# EAGLE schematic backplane (EAGLE 9.6.2)

## Sheet 1 of 5
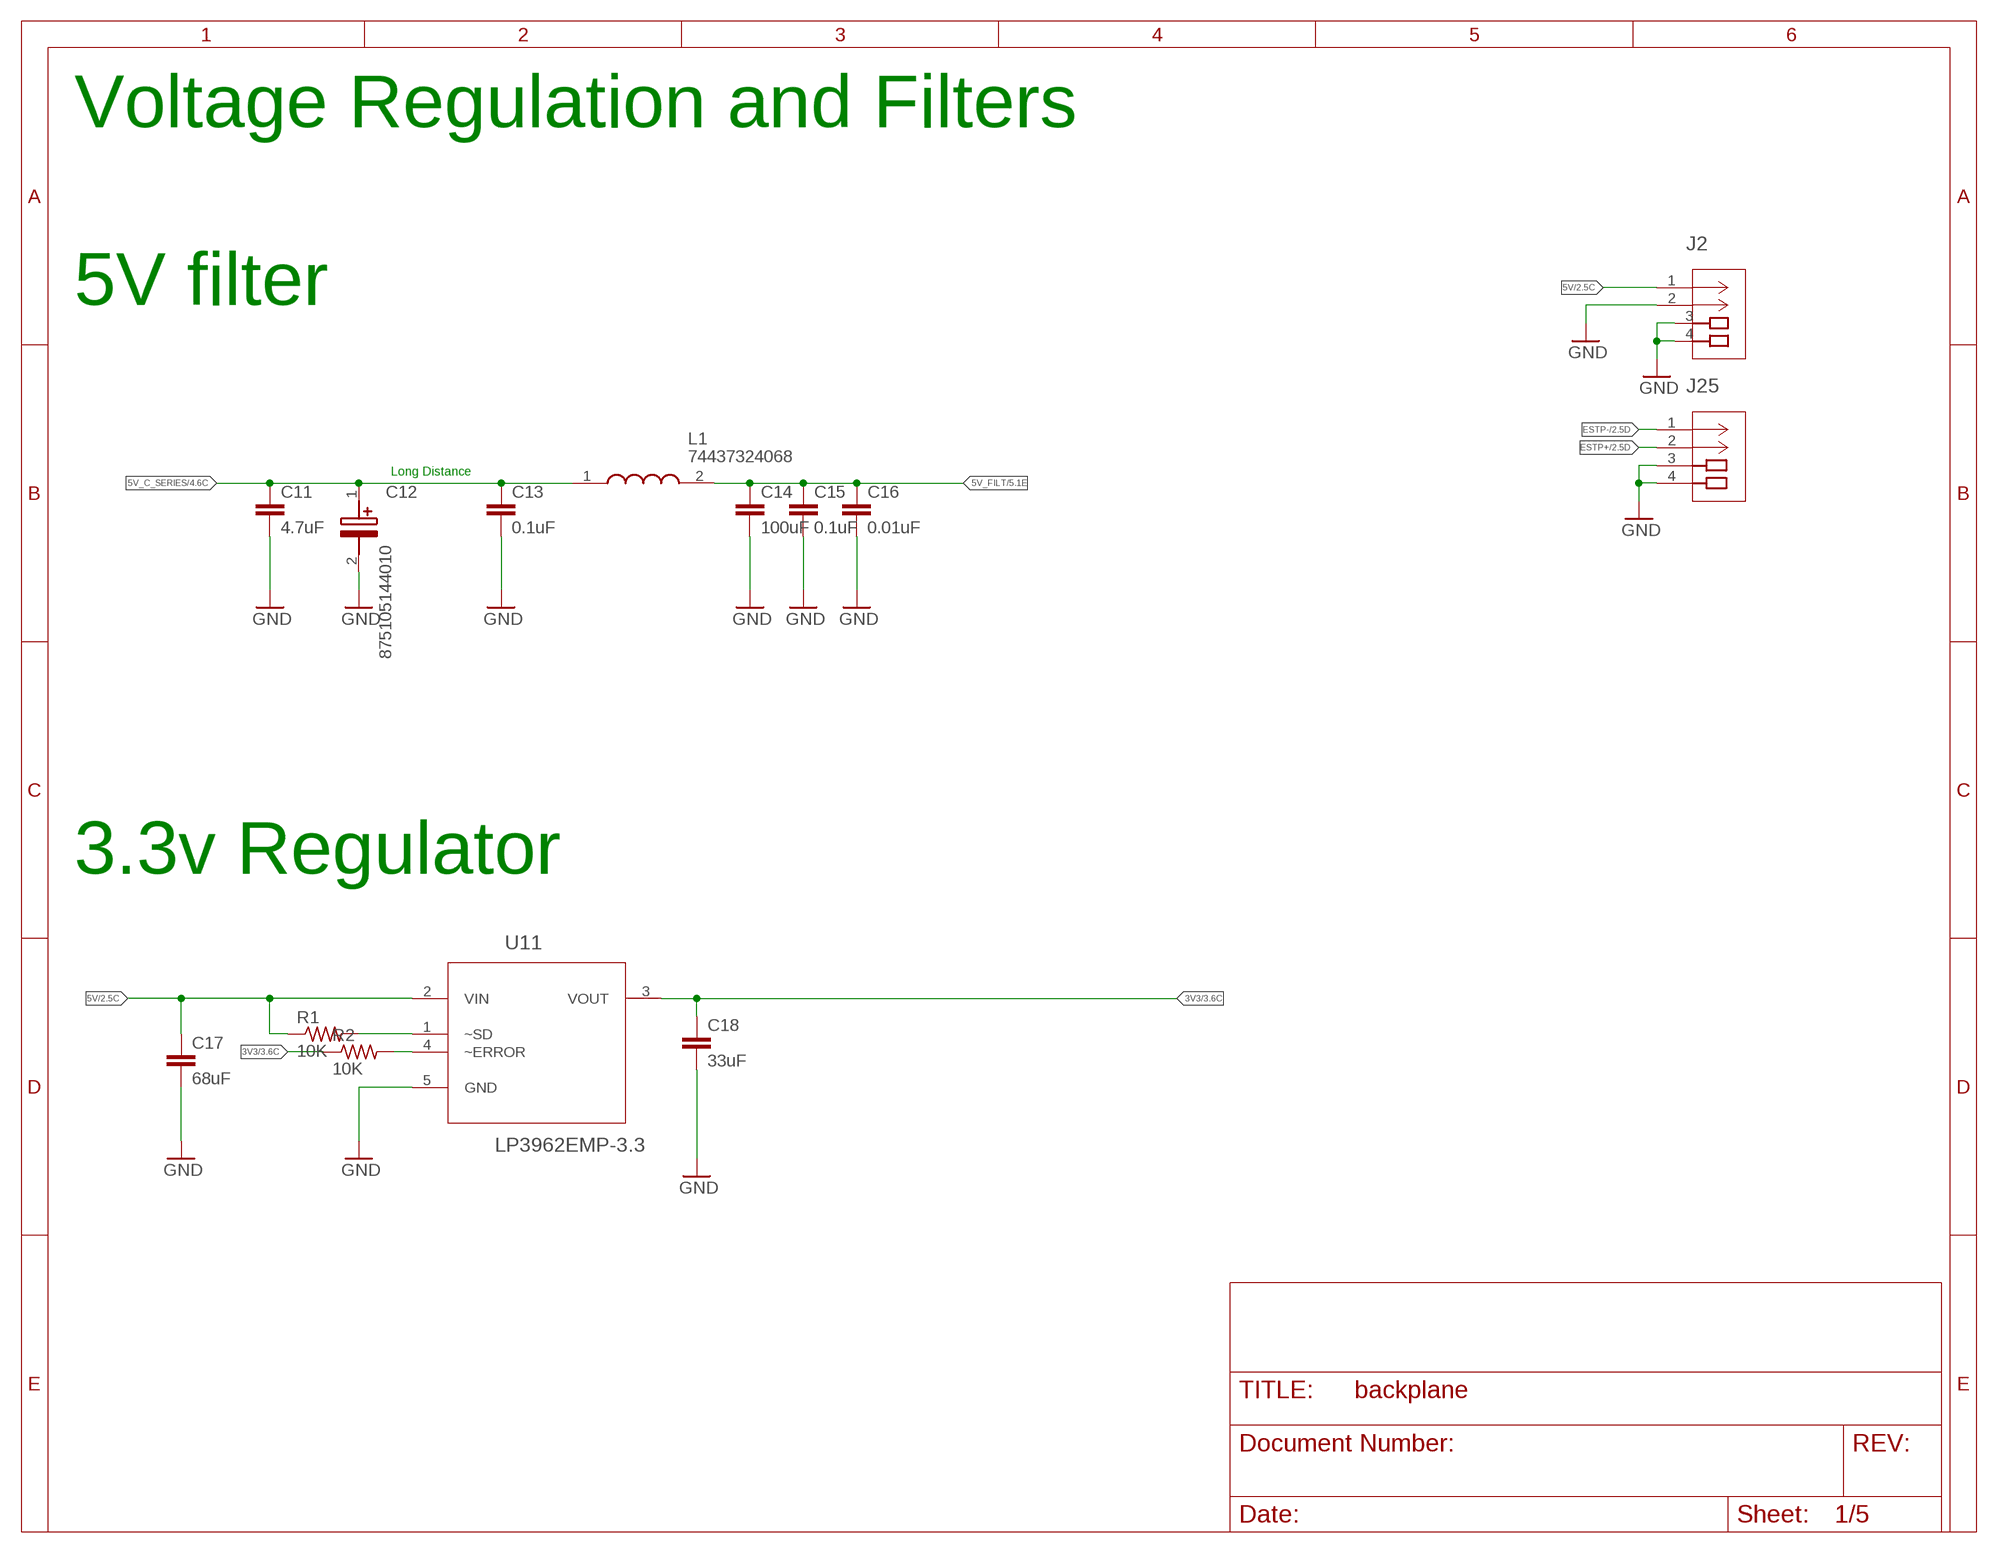
[diagram p0: schematic, sheet 1]

### Parts
C11  4.7uF  C-EUC0603  [C0603]
C12  875105144010  [CAPAE660X580N]
C13  0.1uF  C-EUC0603  [C0603]
C14  100uF  C-EUC1206  [C1206]
C15  0.1uF  C-EUC0603  [C0603]
C16  0.01uF  C-EUC0603  [C0603]
C17  68uF  C-EUC1206  [C1206]
C18  33uF  C-EUC1206  [C1206]
J2  1054301102  [CON_1054301102_MOL]
J25  5055670271  [CON_5055670271]
L1  74437324068  [WE-LHMI_402048]
R1  10K  R-US_R0603  [R0603]
R2  10K  R-US_R0603  [R0603]
U11  LP3962EMP-3.3  [SOT150P696X180-5N]

### Nets
3V3: C18.1 R2.1 U11.3(VOUT) ; also sheet 3
5V: C17.1 J2.1 R1.1 U11.2(VIN) ; also sheet 2
5V_C_SERIES: C11.1 C12.1(+) C13.1 L1.1 ; also sheet 4,5
5V_FILT: C14.1 C15.1 C16.1 L1.2 ; also sheet 5
ESTP+: J25.2 ; also sheet 2
ESTP-: J25.1 ; also sheet 2
GND: C11.2 C12.2(-) C13.2 C14.2 C15.2 C16.2 C17.2 C18.2 J2.2 J2.3 J2.4 J25.3 J25.4 U11.5(GND) ; also sheet 2,3,4,5
N$1: R1.2 U11.1(~SD)
N$2: R2.2 U11.4(~ERROR)

### Notes on the sheet
- Voltage Regulation and Filters
- 5V filter
- Long Distance
- 3.3v Regulator

## Sheet 2 of 5
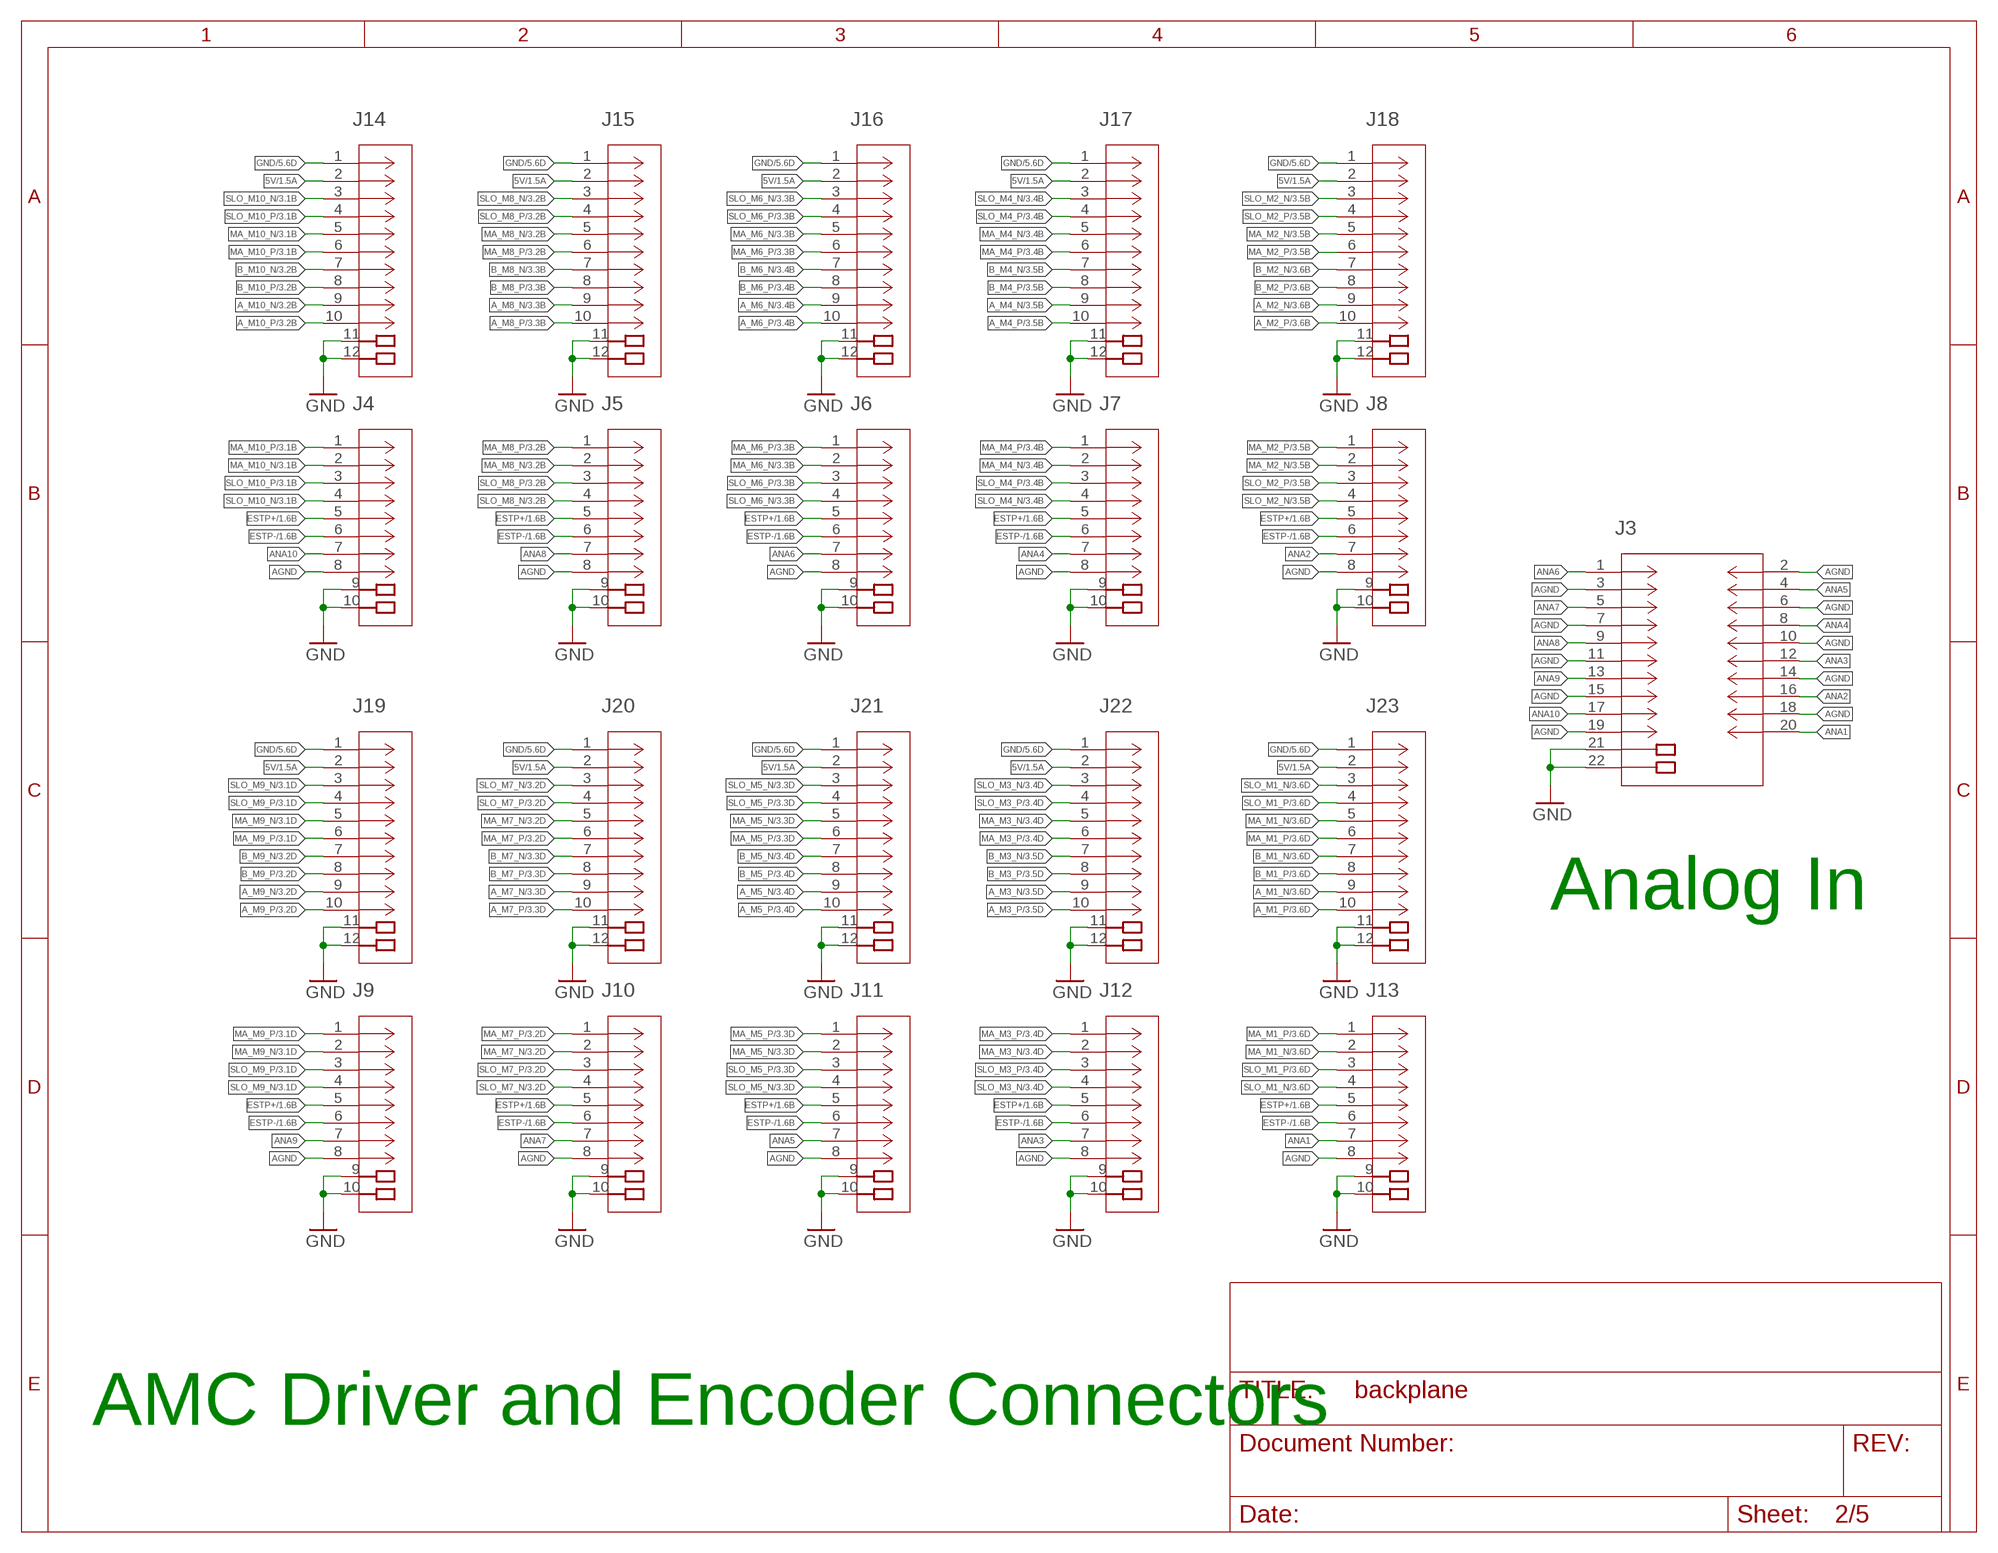
[diagram p1: schematic, sheet 2]

### Parts
J3  5011902017  [CON_5011902017]
J4  5013310807  [CON_5013310807]
J5  5013310807  [CON_5013310807]
J6  5013310807  [CON_5013310807]
J7  5013310807  [CON_5013310807]
J8  5013310807  [CON_5013310807]
J9  5013310807  [CON_5013310807]
J10  5013310807  [CON_5013310807]
J11  5013310807  [CON_5013310807]
J12  5013310807  [CON_5013310807]
J13  5013310807  [CON_5013310807]
J14  5013311007  [CON_5013311007]
J15  5013311007  [CON_5013311007]
J16  5013311007  [CON_5013311007]
J17  5013311007  [CON_5013311007]
J18  5013311007  [CON_5013311007]
J19  5013311007  [CON_5013311007]
J20  5013311007  [CON_5013311007]
J21  5013311007  [CON_5013311007]
J22  5013311007  [CON_5013311007]
J23  5013311007  [CON_5013311007]

### Nets
5V: J14.2 J15.2 J16.2 J17.2 J18.2 J19.2 J20.2 J21.2 J22.2 J23.2 ; also sheet 1
A_M1_N [RS422]: J23.9 ; also sheet 3
A_M1_P [RS422]: J23.10 ; also sheet 3
A_M2_N [RS422]: J18.9 ; also sheet 3
A_M2_P [RS422]: J18.10 ; also sheet 3
A_M3_N [RS422]: J22.9 ; also sheet 3
A_M3_P [RS422]: J22.10 ; also sheet 3
A_M4_N [RS422]: J17.9 ; also sheet 3
A_M4_P [RS422]: J17.10 ; also sheet 3
A_M5_N [RS422]: J21.9 ; also sheet 3
A_M5_P [RS422]: J21.10 ; also sheet 3
A_M6_N [RS422]: J16.9 ; also sheet 3
A_M6_P [RS422]: J16.10 ; also sheet 3
A_M7_N [RS422]: J20.9 ; also sheet 3
A_M7_P [RS422]: J20.10 ; also sheet 3
A_M8_N [RS422]: J15.9 ; also sheet 3
A_M8_P [RS422]: J15.10 ; also sheet 3
A_M9_N [RS422]: J19.9 ; also sheet 3
A_M9_P [RS422]: J19.10 ; also sheet 3
A_M10_N [RS422]: J14.9 ; also sheet 3
A_M10_P [RS422]: J14.10 ; also sheet 3
AGND [Analog]: J3.2 J3.3 J3.6 J3.7 J3.10 J3.11 J3.14 J3.15 J3.18 J3.19 J4.8 J5.8 J6.8 J7.8 J8.8 J9.8 J10.8 J11.8 J12.8 J13.8
ANA1 [Analog]: J3.20 J13.7
ANA2 [Analog]: J3.16 J8.7
ANA3 [Analog]: J3.12 J12.7
ANA4 [Analog]: J3.8 J7.7
ANA5 [Analog]: J3.4 J11.7
ANA6 [Analog]: J3.1 J6.7
ANA7 [Analog]: J3.5 J10.7
ANA8 [Analog]: J3.9 J5.7
ANA9 [Analog]: J3.13 J9.7
ANA10 [Analog]: J3.17 J4.7
B_M1_N [RS422]: J23.7 ; also sheet 3
B_M1_P [RS422]: J23.8 ; also sheet 3
B_M2_N [RS422]: J18.7 ; also sheet 3
B_M2_P [RS422]: J18.8 ; also sheet 3
B_M3_N [RS422]: J22.7 ; also sheet 3
B_M3_P [RS422]: J22.8 ; also sheet 3
B_M4_N [RS422]: J17.7 ; also sheet 3
B_M4_P [RS422]: J17.8 ; also sheet 3
B_M5_N [RS422]: J21.7 ; also sheet 3
B_M5_P [RS422]: J21.8 ; also sheet 3
B_M6_N [RS422]: J16.7 ; also sheet 3
B_M6_P [RS422]: J16.8 ; also sheet 3
B_M7_N [RS422]: J20.7 ; also sheet 3
B_M7_P [RS422]: J20.8 ; also sheet 3
B_M8_N [RS422]: J15.7 ; also sheet 3
B_M8_P [RS422]: J15.8 ; also sheet 3
B_M9_N [RS422]: J19.7 ; also sheet 3
B_M9_P [RS422]: J19.8 ; also sheet 3
B_M10_N [RS422]: J14.7 ; also sheet 3
B_M10_P [RS422]: J14.8 ; also sheet 3
ESTP+: J4.5 J5.5 J6.5 J7.5 J8.5 J9.5 J10.5 J11.5 J12.5 J13.5 ; also sheet 1
ESTP-: J4.6 J5.6 J6.6 J7.6 J8.6 J9.6 J10.6 J11.6 J12.6 J13.6 ; also sheet 1
GND: J3.21 J3.22 J4.9 J4.10 J5.9 J5.10 J6.9 J6.10 J7.9 J7.10 J8.9 J8.10 J9.9 J9.10 J10.9 J10.10 J11.9 J11.10 J12.9 J12.10 J13.9 J13.10 J14.1 J14.11 J14.12 J15.1 J15.11 J15.12 J16.1 J16.11 J16.12 J17.1 J17.11 J17.12 J18.1 J18.11 J18.12 J19.1 J19.11 J19.12 J20.1 J20.11 J20.12 J21.1 J21.11 J21.12 J22.1 J22.11 J22.12 J23.1 J23.11 J23.12 ; also sheet 1,3,4,5
MA_M1_N [RS422]: J13.2 J23.5 ; also sheet 3
MA_M1_P [RS422]: J13.1 J23.6 ; also sheet 3
MA_M2_N [RS422]: J8.2 J18.5 ; also sheet 3
MA_M2_P [RS422]: J8.1 J18.6 ; also sheet 3
MA_M3_N [RS422]: J12.2 J22.5 ; also sheet 3
MA_M3_P [RS422]: J12.1 J22.6 ; also sheet 3
MA_M4_N [RS422]: J7.2 J17.5 ; also sheet 3
MA_M4_P [RS422]: J7.1 J17.6 ; also sheet 3
MA_M5_N [RS422]: J11.2 J21.5 ; also sheet 3
MA_M5_P [RS422]: J11.1 J21.6 ; also sheet 3
MA_M6_N [RS422]: J6.2 J16.5 ; also sheet 3
MA_M6_P [RS422]: J6.1 J16.6 ; also sheet 3
MA_M7_N [RS422]: J10.2 J20.5 ; also sheet 3
MA_M7_P [RS422]: J10.1 J20.6 ; also sheet 3
MA_M8_N [RS422]: J5.2 J15.5 ; also sheet 3
MA_M8_P [RS422]: J5.1 J15.6 ; also sheet 3
MA_M9_N [RS422]: J9.2 J19.5 ; also sheet 3
MA_M9_P [RS422]: J9.1 J19.6 ; also sheet 3
MA_M10_N [RS422]: J4.2 J14.5 ; also sheet 3
MA_M10_P [RS422]: J4.1 J14.6 ; also sheet 3
SLO_M1_N [RS422]: J13.4 J23.3 ; also sheet 3
SLO_M1_P [RS422]: J13.3 J23.4 ; also sheet 3
SLO_M2_N [RS422]: J8.4 J18.3 ; also sheet 3
SLO_M2_P [RS422]: J8.3 J18.4 ; also sheet 3
SLO_M3_N [RS422]: J12.4 J22.3 ; also sheet 3
SLO_M3_P [RS422]: J12.3 J22.4 ; also sheet 3
SLO_M4_N [RS422]: J7.4 J17.3 ; also sheet 3
SLO_M4_P [RS422]: J7.3 J17.4 ; also sheet 3
SLO_M5_N [RS422]: J11.4 J21.3 ; also sheet 3
SLO_M5_P [RS422]: J11.3 J21.4 ; also sheet 3
SLO_M6_N [RS422]: J6.4 J16.3 ; also sheet 3
SLO_M6_P [RS422]: J6.3 J16.4 ; also sheet 3
SLO_M7_N [RS422]: J10.4 J20.3 ; also sheet 3
SLO_M7_P [RS422]: J10.3 J20.4 ; also sheet 3
SLO_M8_N [RS422]: J5.4 J15.3 ; also sheet 3
SLO_M8_P [RS422]: J5.3 J15.4 ; also sheet 3
SLO_M9_N [RS422]: J9.4 J19.3 ; also sheet 3
SLO_M9_P [RS422]: J9.3 J19.4 ; also sheet 3
SLO_M10_N [RS422]: J4.4 J14.3 ; also sheet 3
SLO_M10_P [RS422]: J4.3 J14.4 ; also sheet 3

### Notes on the sheet
- Analog In
- AMC Driver and Encoder Connectors

## Sheet 3 of 5
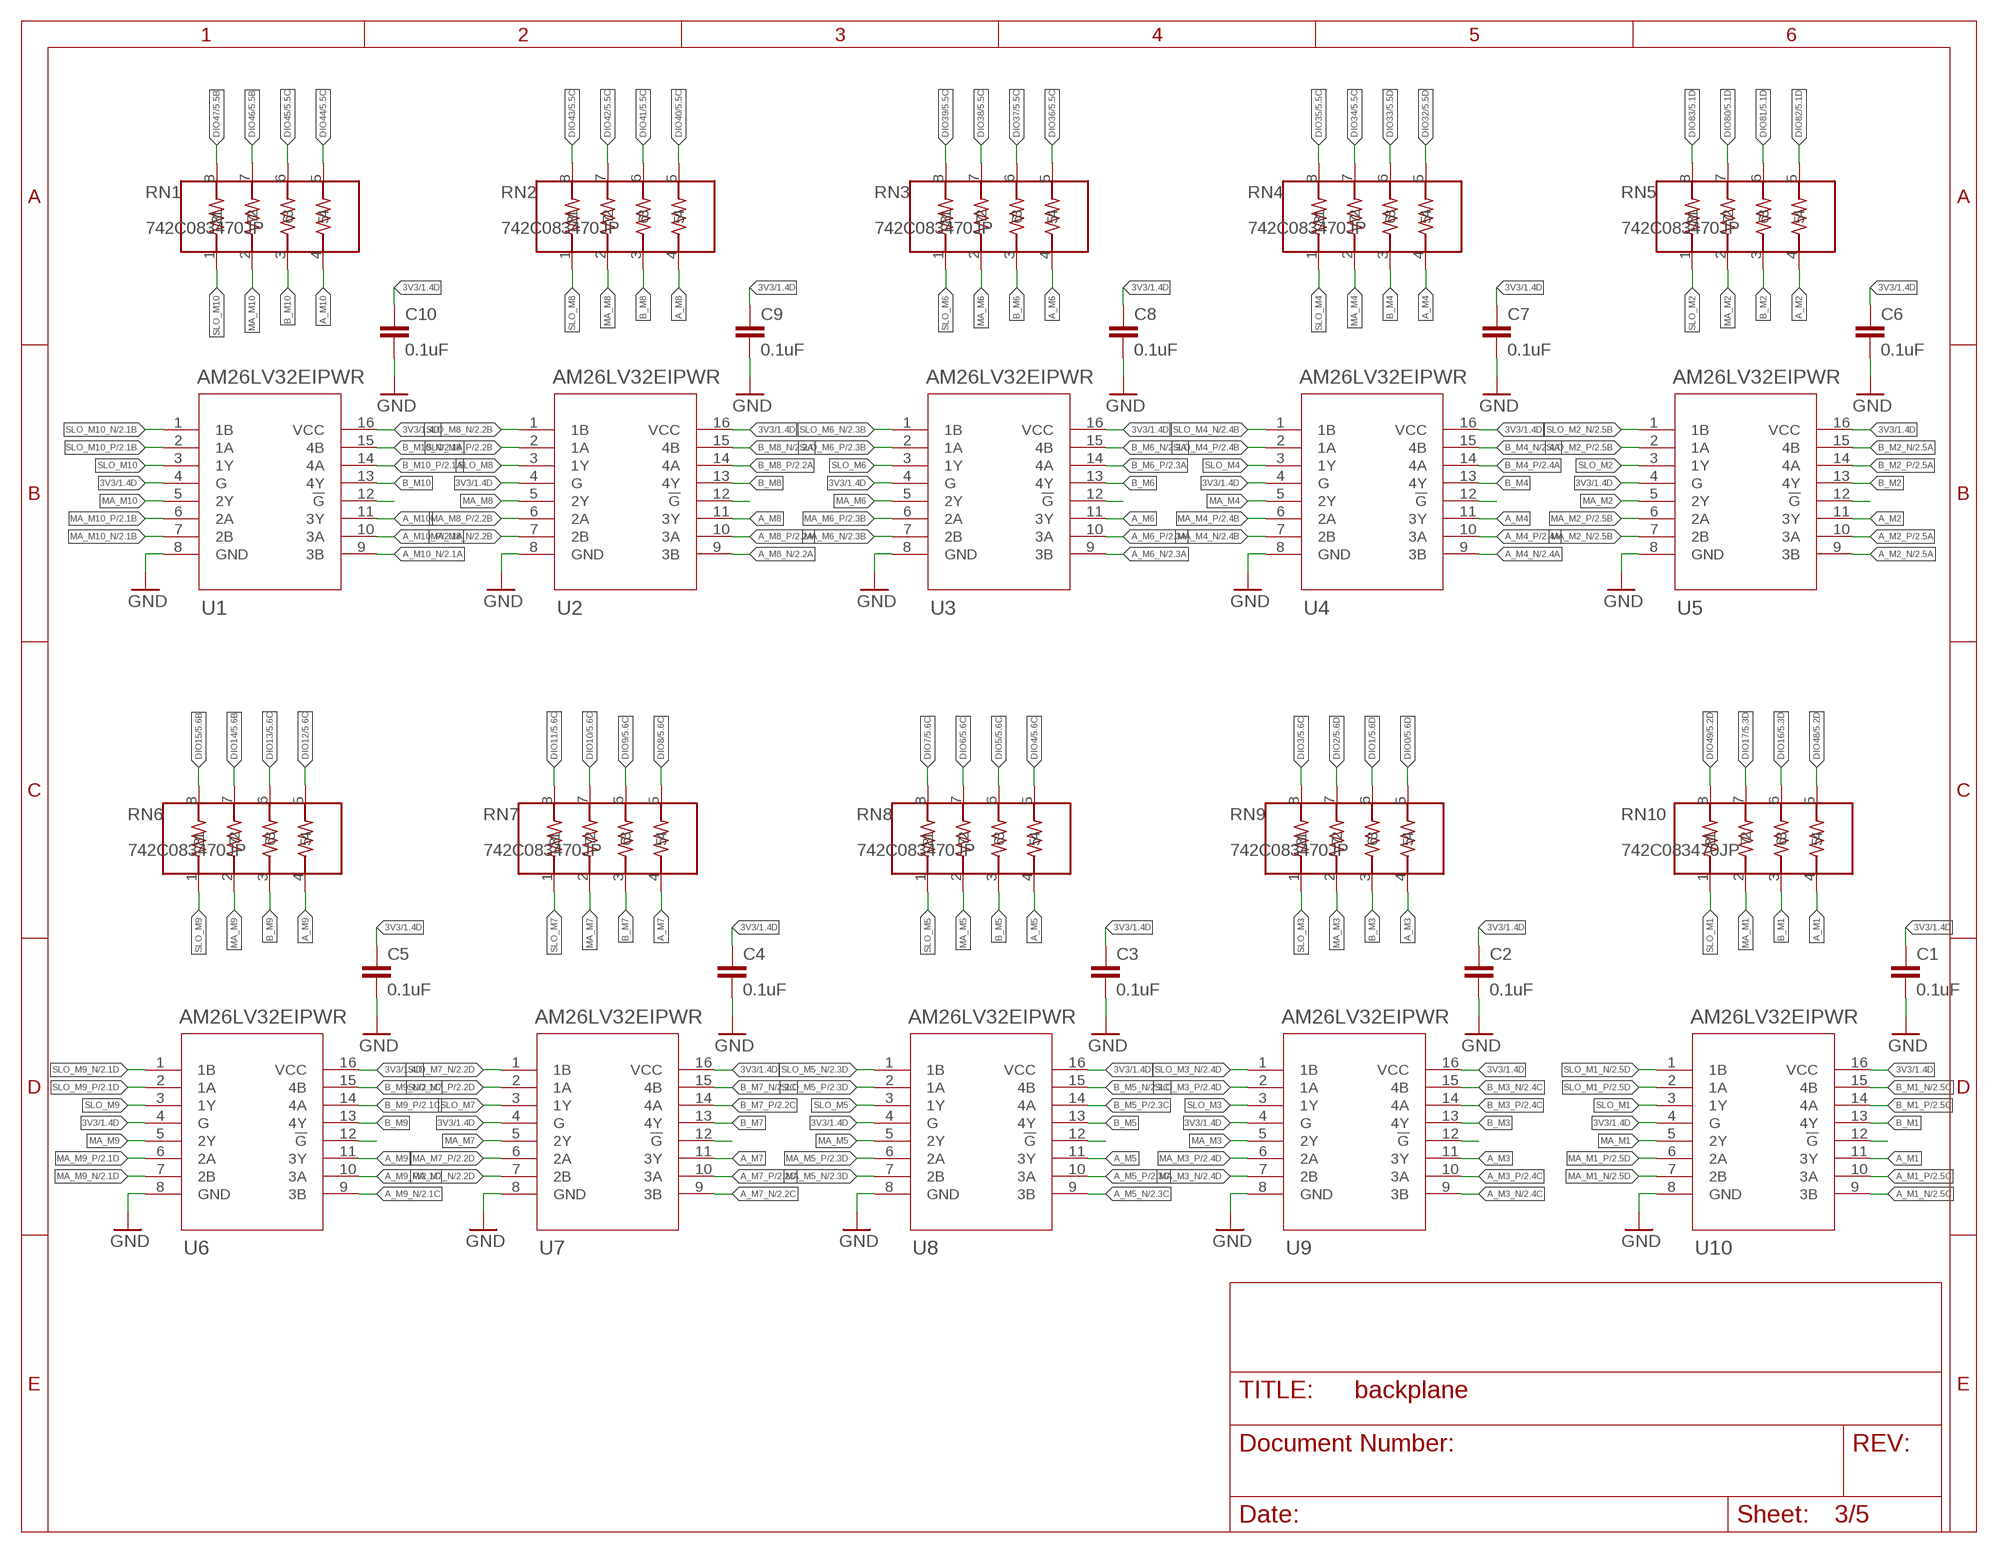
[diagram p2: schematic, sheet 3]

### Parts
C1  0.1uF  C-EUC0603  [C0603]
C2  0.1uF  C-EUC0603  [C0603]
C3  0.1uF  C-EUC0603  [C0603]
C4  0.1uF  C-EUC0603  [C0603]
C5  0.1uF  C-EUC0603  [C0603]
C6  0.1uF  C-EUC0603  [C0603]
C7  0.1uF  C-EUC0603  [C0603]
C8  0.1uF  C-EUC0603  [C0603]
C9  0.1uF  C-EUC0603  [C0603]
C10  0.1uF  C-EUC0603  [C0603]
RN1  742C083470JP  [RESCAV80P320X160X70-8N]
RN2  742C083470JP  [RESCAV80P320X160X70-8N]
RN3  742C083470JP  [RESCAV80P320X160X70-8N]
RN4  742C083470JP  [RESCAV80P320X160X70-8N]
RN5  742C083470JP  [RESCAV80P320X160X70-8N]
RN6  742C083470JP  [RESCAV80P320X160X70-8N]
RN7  742C083470JP  [RESCAV80P320X160X70-8N]
RN8  742C083470JP  [RESCAV80P320X160X70-8N]
RN9  742C083470JP  [RESCAV80P320X160X70-8N]
RN10  742C083470JP  [RESCAV80P320X160X70-8N]
U1  AM26LV32EIPWR  [PW16]
U2  AM26LV32EIPWR  [PW16]
U3  AM26LV32EIPWR  [PW16]
U4  AM26LV32EIPWR  [PW16]
U5  AM26LV32EIPWR  [PW16]
U6  AM26LV32EIPWR  [PW16]
U7  AM26LV32EIPWR  [PW16]
U8  AM26LV32EIPWR  [PW16]
U9  AM26LV32EIPWR  [PW16]
U10  AM26LV32EIPWR  [PW16]

### Nets
3V3: C1.1 C2.1 C3.1 C4.1 C5.1 C6.1 C7.1 C8.1 C9.1 C10.1 U1.4(G) U1.16(VCC) U2.4(G) U2.16(VCC) U3.4(G) U3.16(VCC) U4.4(G) U4.16(VCC) U5.4(G) U5.16(VCC) U6.4(G) U6.16(VCC) U7.4(G) U7.16(VCC) U8.4(G) U8.16(VCC) U9.4(G) U9.16(VCC) U10.4(G) U10.16(VCC) ; also sheet 1
A_M1: RN10.4 U10.11(3Y)
A_M1_N [RS422]: U10.9(3B) ; also sheet 2
A_M1_P [RS422]: U10.10(3A) ; also sheet 2
A_M2: RN5.4 U5.11(3Y)
A_M2_N [RS422]: U5.9(3B) ; also sheet 2
A_M2_P [RS422]: U5.10(3A) ; also sheet 2
A_M3: RN9.4 U9.11(3Y)
A_M3_N [RS422]: U9.9(3B) ; also sheet 2
A_M3_P [RS422]: U9.10(3A) ; also sheet 2
A_M4: RN4.4 U4.11(3Y)
A_M4_N [RS422]: U4.9(3B) ; also sheet 2
A_M4_P [RS422]: U4.10(3A) ; also sheet 2
A_M5: RN8.4 U8.11(3Y)
A_M5_N [RS422]: U8.9(3B) ; also sheet 2
A_M5_P [RS422]: U8.10(3A) ; also sheet 2
A_M6: RN3.4 U3.11(3Y)
A_M6_N [RS422]: U3.9(3B) ; also sheet 2
A_M6_P [RS422]: U3.10(3A) ; also sheet 2
A_M7: RN7.4 U7.11(3Y)
A_M7_N [RS422]: U7.9(3B) ; also sheet 2
A_M7_P [RS422]: U7.10(3A) ; also sheet 2
A_M8: RN2.4 U2.11(3Y)
A_M8_N [RS422]: U2.9(3B) ; also sheet 2
A_M8_P [RS422]: U2.10(3A) ; also sheet 2
A_M9: RN6.4 U6.11(3Y)
A_M9_N [RS422]: U6.9(3B) ; also sheet 2
A_M9_P [RS422]: U6.10(3A) ; also sheet 2
A_M10: RN1.4 U1.11(3Y)
A_M10_N [RS422]: U1.9(3B) ; also sheet 2
A_M10_P [RS422]: U1.10(3A) ; also sheet 2
B_M1: RN10.3 U10.13(4Y)
B_M1_N [RS422]: U10.15(4B) ; also sheet 2
B_M1_P [RS422]: U10.14(4A) ; also sheet 2
B_M2: RN5.3 U5.13(4Y)
B_M2_N [RS422]: U5.15(4B) ; also sheet 2
B_M2_P [RS422]: U5.14(4A) ; also sheet 2
B_M3: RN9.3 U9.13(4Y)
B_M3_N [RS422]: U9.15(4B) ; also sheet 2
B_M3_P [RS422]: U9.14(4A) ; also sheet 2
B_M4: RN4.3 U4.13(4Y)
B_M4_N [RS422]: U4.15(4B) ; also sheet 2
B_M4_P [RS422]: U4.14(4A) ; also sheet 2
B_M5: RN8.3 U8.13(4Y)
B_M5_N [RS422]: U8.15(4B) ; also sheet 2
B_M5_P [RS422]: U8.14(4A) ; also sheet 2
B_M6: RN3.3 U3.13(4Y)
B_M6_N [RS422]: U3.15(4B) ; also sheet 2
B_M6_P [RS422]: U3.14(4A) ; also sheet 2
B_M7: RN7.3 U7.13(4Y)
B_M7_N [RS422]: U7.15(4B) ; also sheet 2
B_M7_P [RS422]: U7.14(4A) ; also sheet 2
B_M8: RN2.3 U2.13(4Y)
B_M8_N [RS422]: U2.15(4B) ; also sheet 2
B_M8_P [RS422]: U2.14(4A) ; also sheet 2
B_M9: RN6.3 U6.13(4Y)
B_M9_N [RS422]: U6.15(4B) ; also sheet 2
B_M9_P [RS422]: U6.14(4A) ; also sheet 2
B_M10: RN1.3 U1.13(4Y)
B_M10_N [RS422]: U1.15(4B) ; also sheet 2
B_M10_P [RS422]: U1.14(4A) ; also sheet 2
DIO0: RN9.5 ; also sheet 5
DIO1: RN9.6 ; also sheet 5
DIO2: RN9.7 ; also sheet 5
DIO3: RN9.8 ; also sheet 5
DIO4: RN8.5 ; also sheet 5
DIO5: RN8.6 ; also sheet 5
DIO6: RN8.7 ; also sheet 5
DIO7: RN8.8 ; also sheet 5
DIO8: RN7.5 ; also sheet 5
DIO9: RN7.6 ; also sheet 5
DIO10: RN7.7 ; also sheet 5
DIO11: RN7.8 ; also sheet 5
DIO12: RN6.5 ; also sheet 5
DIO13: RN6.6 ; also sheet 5
DIO14: RN6.7 ; also sheet 5
DIO15: RN6.8 ; also sheet 5
DIO16: RN10.6 ; also sheet 5
DIO17: RN10.7 ; also sheet 5
DIO32: RN4.5 ; also sheet 5
DIO33: RN4.6 ; also sheet 5
DIO34: RN4.7 ; also sheet 5
DIO35: RN4.8 ; also sheet 5
DIO36: RN3.5 ; also sheet 5
DIO37: RN3.6 ; also sheet 5
DIO38: RN3.7 ; also sheet 5
DIO39: RN3.8 ; also sheet 5
DIO40: RN2.5 ; also sheet 5
DIO41: RN2.6 ; also sheet 5
DIO42: RN2.7 ; also sheet 5
DIO43: RN2.8 ; also sheet 5
DIO44: RN1.5 ; also sheet 5
DIO45: RN1.6 ; also sheet 5
DIO46: RN1.7 ; also sheet 5
DIO47: RN1.8 ; also sheet 5
DIO48: RN10.5 ; also sheet 5
DIO49: RN10.8 ; also sheet 5
DIO80: RN5.7 ; also sheet 5
DIO81: RN5.6 ; also sheet 5
DIO82: RN5.5 ; also sheet 5
DIO83: RN5.8 ; also sheet 5
GND: C1.2 C2.2 C3.2 C4.2 C5.2 C6.2 C7.2 C8.2 C9.2 C10.2 U1.8(GND) U2.8(GND) U3.8(GND) U4.8(GND) U5.8(GND) U6.8(GND) U7.8(GND) U8.8(GND) U9.8(GND) U10.8(GND) ; also sheet 1,2,4,5
MA_M1: RN10.2 U10.5(2Y)
MA_M1_N [RS422]: U10.7(2B) ; also sheet 2
MA_M1_P [RS422]: U10.6(2A) ; also sheet 2
MA_M2: RN5.2 U5.5(2Y)
MA_M2_N [RS422]: U5.7(2B) ; also sheet 2
MA_M2_P [RS422]: U5.6(2A) ; also sheet 2
MA_M3: RN9.2 U9.5(2Y)
MA_M3_N [RS422]: U9.7(2B) ; also sheet 2
MA_M3_P [RS422]: U9.6(2A) ; also sheet 2
MA_M4: RN4.2 U4.5(2Y)
MA_M4_N [RS422]: U4.7(2B) ; also sheet 2
MA_M4_P [RS422]: U4.6(2A) ; also sheet 2
MA_M5: RN8.2 U8.5(2Y)
MA_M5_N [RS422]: U8.7(2B) ; also sheet 2
MA_M5_P [RS422]: U8.6(2A) ; also sheet 2
MA_M6: RN3.2 U3.5(2Y)
MA_M6_N [RS422]: U3.7(2B) ; also sheet 2
MA_M6_P [RS422]: U3.6(2A) ; also sheet 2
MA_M7: RN7.2 U7.5(2Y)
MA_M7_N [RS422]: U7.7(2B) ; also sheet 2
MA_M7_P [RS422]: U7.6(2A) ; also sheet 2
MA_M8: RN2.2 U2.5(2Y)
MA_M8_N [RS422]: U2.7(2B) ; also sheet 2
MA_M8_P [RS422]: U2.6(2A) ; also sheet 2
MA_M9: RN6.2 U6.5(2Y)
MA_M9_N [RS422]: U6.7(2B) ; also sheet 2
MA_M9_P [RS422]: U6.6(2A) ; also sheet 2
MA_M10: RN1.2 U1.5(2Y)
MA_M10_N [RS422]: U1.7(2B) ; also sheet 2
MA_M10_P [RS422]: U1.6(2A) ; also sheet 2
N$4: U10.12(!G)
N$23: U9.12(!G)
N$37: U8.12(!G)
N$51: U7.12(!G)
N$67: U6.12(!G)
N$85: U5.12(!G)
N$99: U4.12(!G)
N$115: U3.12(!G)
N$131: U2.12(!G)
N$147: U1.12(!G)
SLO_M1: RN10.1 U10.3(1Y)
SLO_M1_N [RS422]: U10.1(1B) ; also sheet 2
SLO_M1_P [RS422]: U10.2(1A) ; also sheet 2
SLO_M2: RN5.1 U5.3(1Y)
SLO_M2_N [RS422]: U5.1(1B) ; also sheet 2
SLO_M2_P [RS422]: U5.2(1A) ; also sheet 2
SLO_M3: RN9.1 U9.3(1Y)
SLO_M3_N [RS422]: U9.1(1B) ; also sheet 2
SLO_M3_P [RS422]: U9.2(1A) ; also sheet 2
SLO_M4: RN4.1 U4.3(1Y)
SLO_M4_N [RS422]: U4.1(1B) ; also sheet 2
SLO_M4_P [RS422]: U4.2(1A) ; also sheet 2
SLO_M5: RN8.1 U8.3(1Y)
SLO_M5_N [RS422]: U8.1(1B) ; also sheet 2
SLO_M5_P [RS422]: U8.2(1A) ; also sheet 2
SLO_M6: RN3.1 U3.3(1Y)
SLO_M6_N [RS422]: U3.1(1B) ; also sheet 2
SLO_M6_P [RS422]: U3.2(1A) ; also sheet 2
SLO_M7: RN7.1 U7.3(1Y)
SLO_M7_N [RS422]: U7.1(1B) ; also sheet 2
SLO_M7_P [RS422]: U7.2(1A) ; also sheet 2
SLO_M8: RN2.1 U2.3(1Y)
SLO_M8_N [RS422]: U2.1(1B) ; also sheet 2
SLO_M8_P [RS422]: U2.2(1A) ; also sheet 2
SLO_M9: RN6.1 U6.3(1Y)
SLO_M9_N [RS422]: U6.1(1B) ; also sheet 2
SLO_M9_P [RS422]: U6.2(1A) ; also sheet 2
SLO_M10: RN1.1 U1.3(1Y)
SLO_M10_N [RS422]: U1.1(1B) ; also sheet 2
SLO_M10_P [RS422]: U1.2(1A) ; also sheet 2

## Sheet 4 of 5
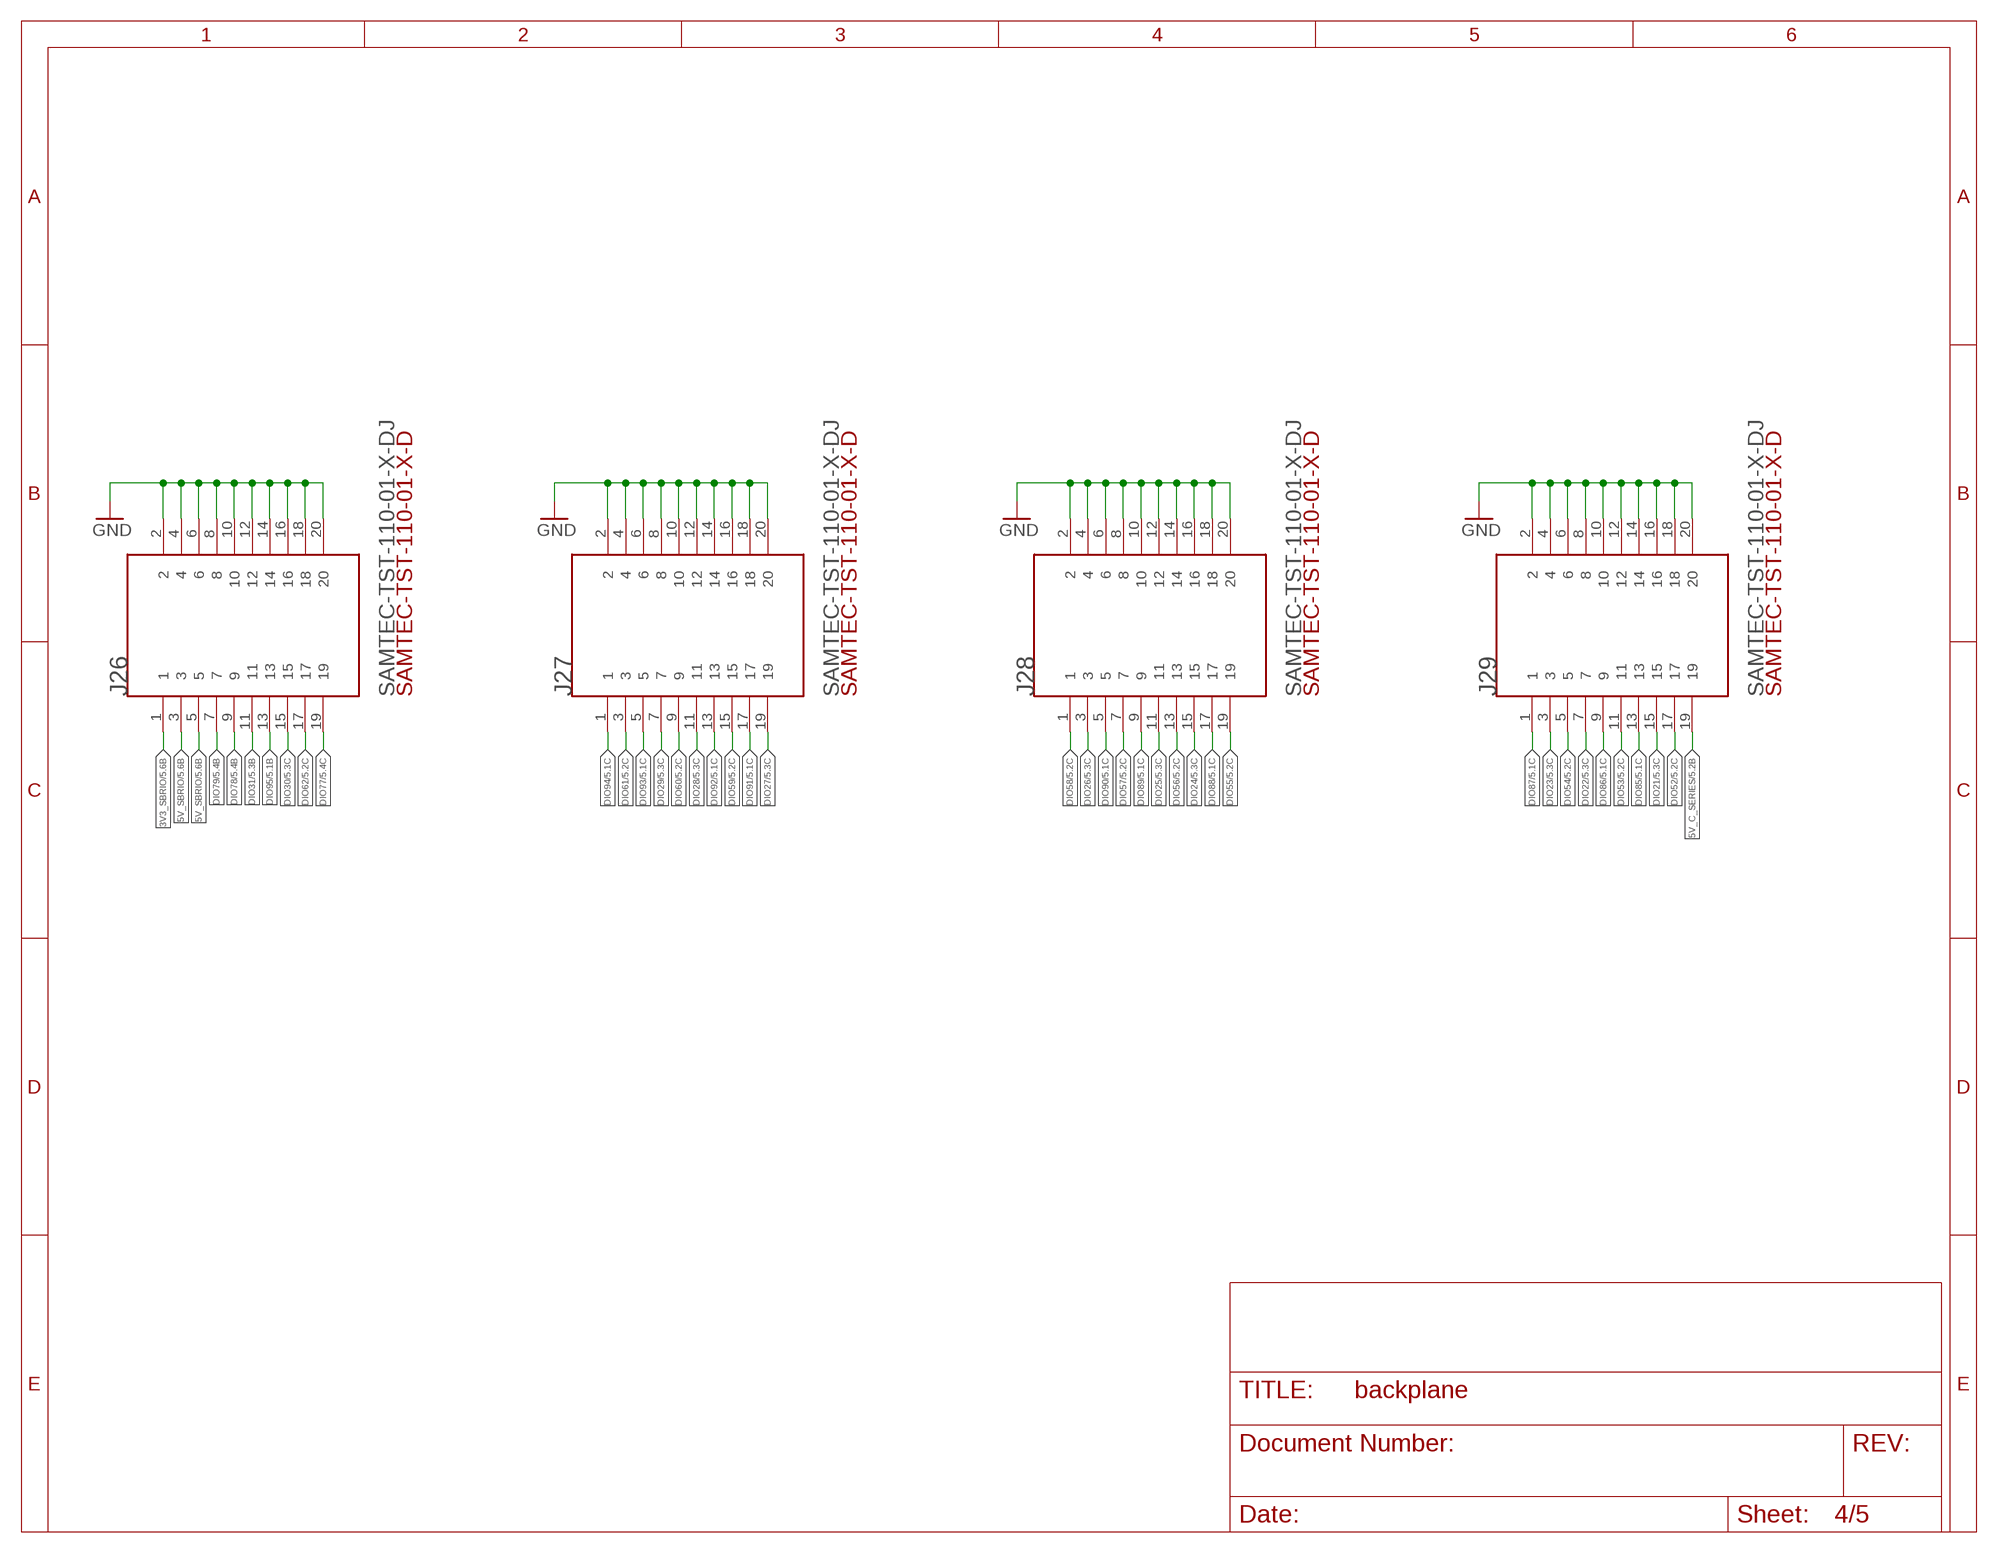
[diagram p3: schematic, sheet 4]

### Parts
J26  SAMTEC-TST-110-01-X-DJ  [SAMTEC-TST-110-01-X-D]
J27  SAMTEC-TST-110-01-X-DJ  [SAMTEC-TST-110-01-X-D]
J28  SAMTEC-TST-110-01-X-DJ  [SAMTEC-TST-110-01-X-D]
J29  SAMTEC-TST-110-01-X-DJ  [SAMTEC-TST-110-01-X-D]

### Nets
3V3_SBRIO: J26.1 ; also sheet 5
5V_C_SERIES: J29.19 ; also sheet 1,5
5V_SBRIO: J26.3 J26.5 ; also sheet 5
DIO21: J29.15 ; also sheet 5
DIO22: J29.7 ; also sheet 5
DIO23: J29.3 ; also sheet 5
DIO24: J28.15 ; also sheet 5
DIO25: J28.11 ; also sheet 5
DIO26: J28.3 ; also sheet 5
DIO27: J27.19 ; also sheet 5
DIO28: J27.11 ; also sheet 5
DIO29: J27.7 ; also sheet 5
DIO30: J26.15 ; also sheet 5
DIO31: J26.11 ; also sheet 5
DIO52: J29.17 ; also sheet 5
DIO53: J29.11 ; also sheet 5
DIO54: J29.5 ; also sheet 5
DIO55: J28.19 ; also sheet 5
DIO56: J28.13 ; also sheet 5
DIO57: J28.7 ; also sheet 5
DIO58: J28.1 ; also sheet 5
DIO59: J27.15 ; also sheet 5
DIO60: J27.9 ; also sheet 5
DIO61: J27.3 ; also sheet 5
DIO62: J26.17 ; also sheet 5
DIO77: J26.19 ; also sheet 5
DIO78: J26.9 ; also sheet 5
DIO79: J26.7 ; also sheet 5
DIO85: J29.13 ; also sheet 5
DIO86: J29.9 ; also sheet 5
DIO87: J29.1 ; also sheet 5
DIO88: J28.17 ; also sheet 5
DIO89: J28.9 ; also sheet 5
DIO90: J28.5 ; also sheet 5
DIO91: J27.17 ; also sheet 5
DIO92: J27.13 ; also sheet 5
DIO93: J27.5 ; also sheet 5
DIO94: J27.1 ; also sheet 5
DIO95: J26.13 ; also sheet 5
GND: J26.2 J26.4 J26.6 J26.8 J26.10 J26.12 J26.14 J26.16 J26.18 J26.20 J27.2 J27.4 J27.6 J27.8 J27.10 J27.12 J27.14 J27.16 J27.18 J27.20 J28.2 J28.4 J28.6 J28.8 J28.10 J28.12 J28.14 J28.16 J28.18 J28.20 J29.2 J29.4 J29.6 J29.8 J29.10 J29.12 J29.14 J29.16 J29.18 J29.20 ; also sheet 1,2,3,5

## Sheet 5 of 5
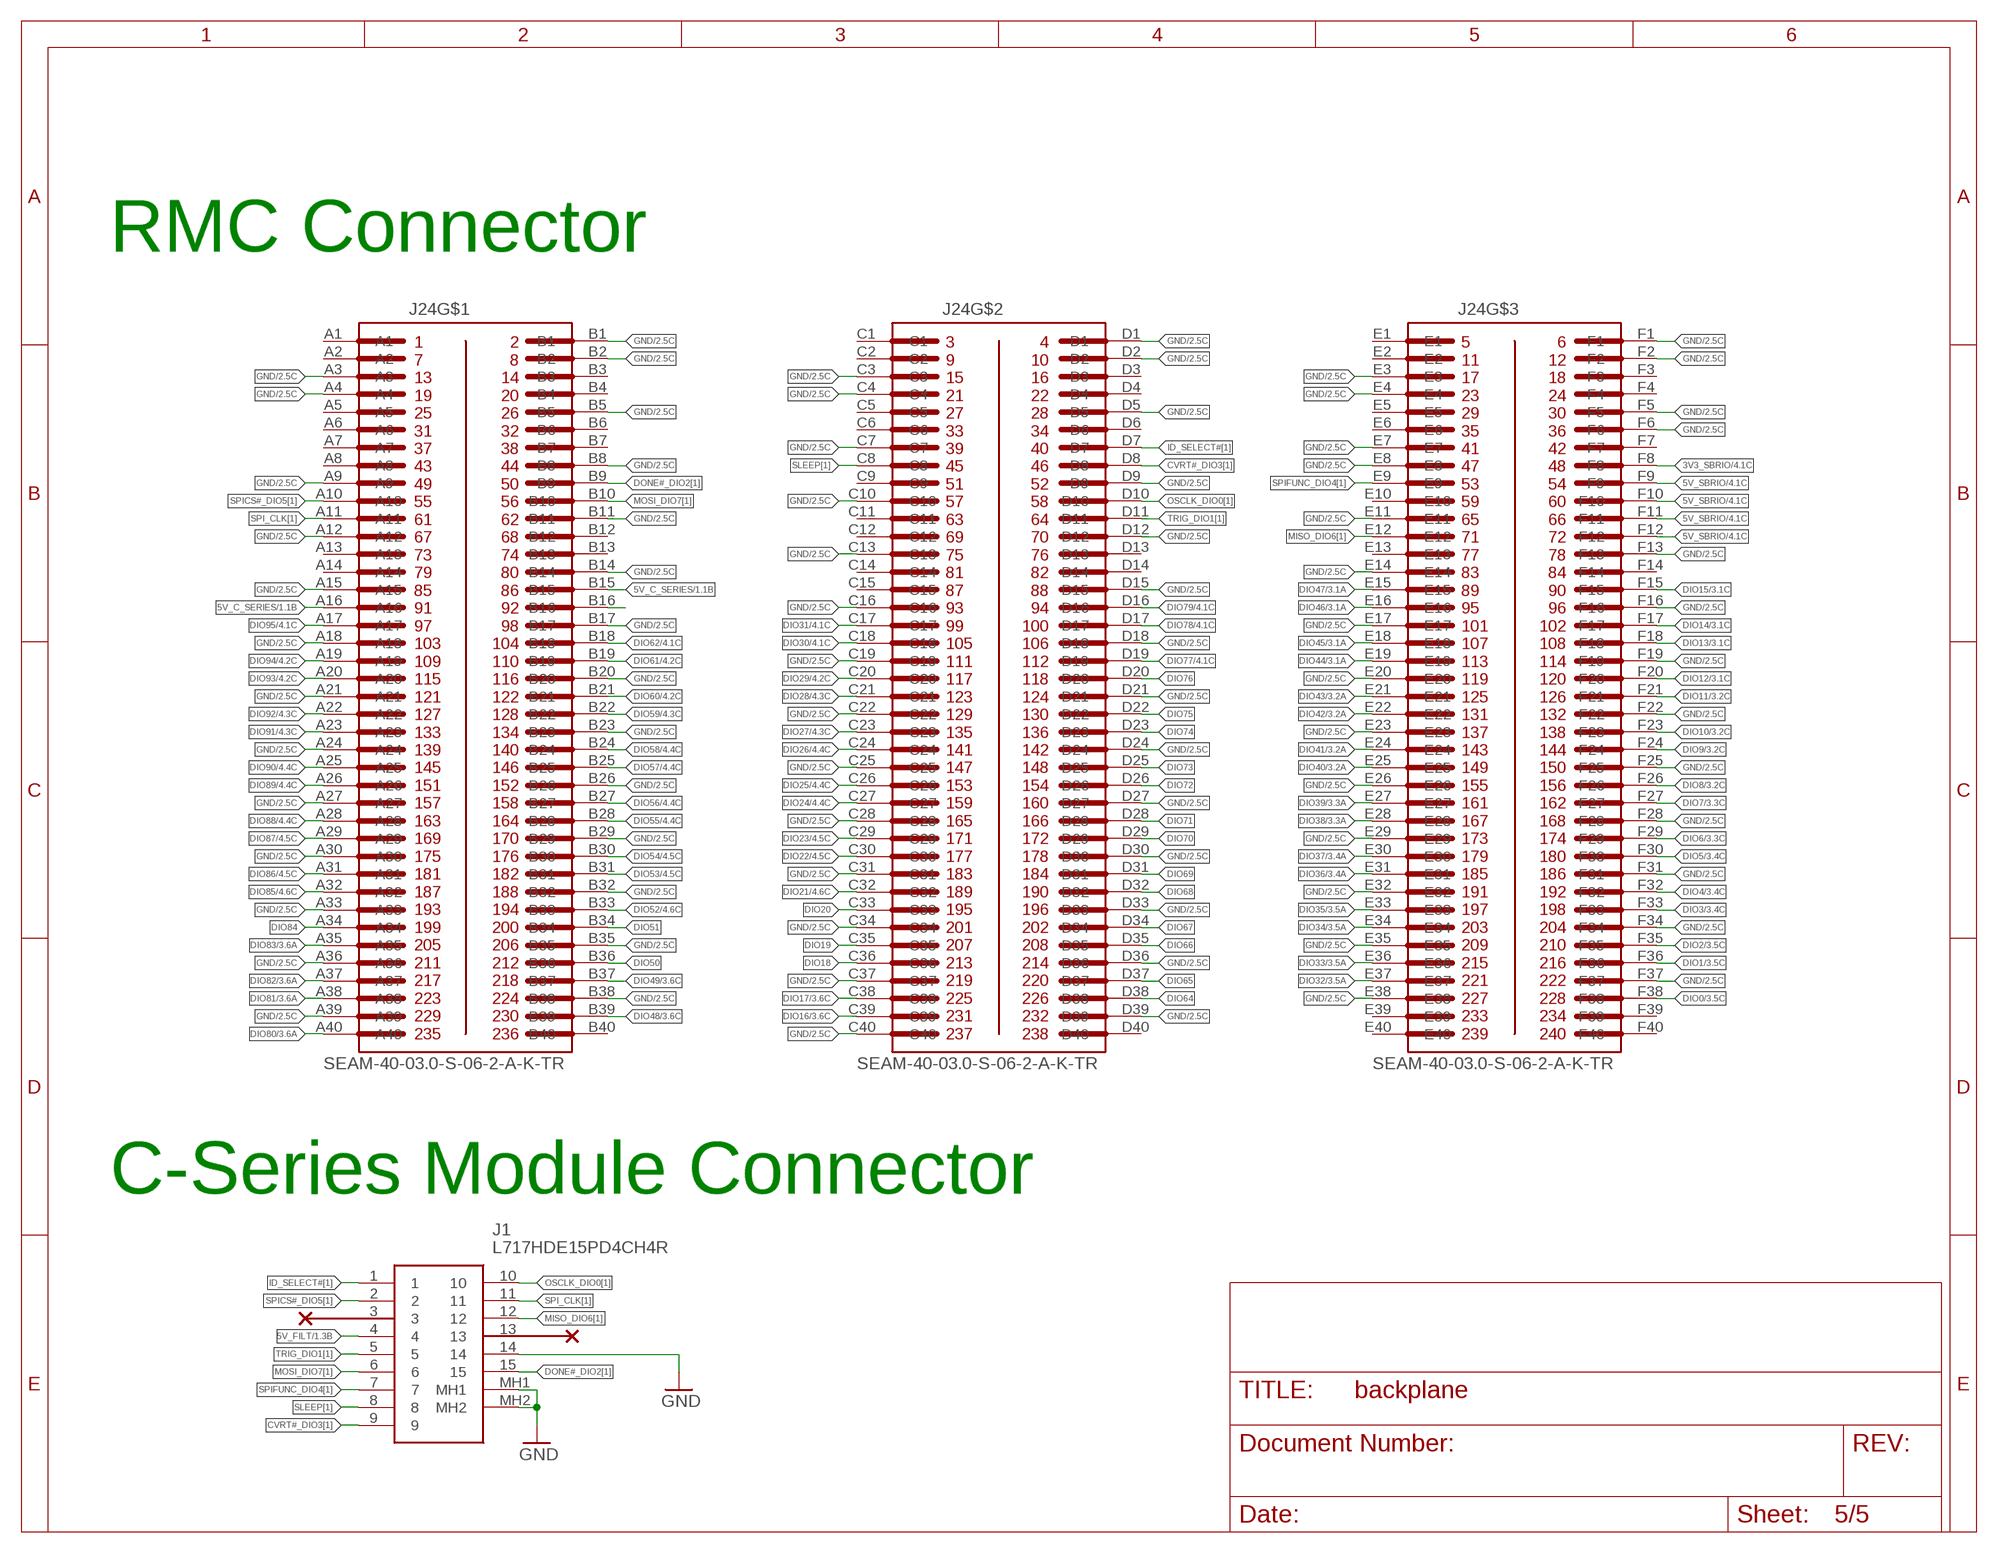
[diagram p4: schematic, sheet 5]

### Parts
J1  L717HDE15PD4CH4R  [L717HDE15PD4CH4R]
J24  SEAM-40-03.0-S-06-2-A-K-TR  [SAMTEC_SEAM-40-03.0-S-06-2-A-K-TR]

### Nets
3V3_SBRIO: J24.F8 ; also sheet 4
5V_C_SERIES: J24.A16 J24.B15 ; also sheet 1,4
5V_FILT: J1.4 ; also sheet 1
5V_SBRIO: J24.F9 J24.F10 J24.F11 J24.F12 ; also sheet 4
CVRT#_DIO3[1]: J1.9 J24.D8
DIO0: J24.F38 ; also sheet 3
DIO1: J24.F36 ; also sheet 3
DIO2: J24.F35 ; also sheet 3
DIO3: J24.F33 ; also sheet 3
DIO4: J24.F32 ; also sheet 3
DIO5: J24.F30 ; also sheet 3
DIO6: J24.F29 ; also sheet 3
DIO7: J24.F27 ; also sheet 3
DIO8: J24.F26 ; also sheet 3
DIO9: J24.F24 ; also sheet 3
DIO10: J24.F23 ; also sheet 3
DIO11: J24.F21 ; also sheet 3
DIO12: J24.F20 ; also sheet 3
DIO13: J24.F18 ; also sheet 3
DIO14: J24.F17 ; also sheet 3
DIO15: J24.F15 ; also sheet 3
DIO16: J24.C39 ; also sheet 3
DIO17: J24.C38 ; also sheet 3
DIO18: J24.C36
DIO19: J24.C35
DIO20: J24.C33
DIO21: J24.C32 ; also sheet 4
DIO22: J24.C30 ; also sheet 4
DIO23: J24.C29 ; also sheet 4
DIO24: J24.C27 ; also sheet 4
DIO25: J24.C26 ; also sheet 4
DIO26: J24.C24 ; also sheet 4
DIO27: J24.C23 ; also sheet 4
DIO28: J24.C21 ; also sheet 4
DIO29: J24.C20 ; also sheet 4
DIO30: J24.C18 ; also sheet 4
DIO31: J24.C17 ; also sheet 4
DIO32: J24.E37 ; also sheet 3
DIO33: J24.E36 ; also sheet 3
DIO34: J24.E34 ; also sheet 3
DIO35: J24.E33 ; also sheet 3
DIO36: J24.E31 ; also sheet 3
DIO37: J24.E30 ; also sheet 3
DIO38: J24.E28 ; also sheet 3
DIO39: J24.E27 ; also sheet 3
DIO40: J24.E25 ; also sheet 3
DIO41: J24.E24 ; also sheet 3
DIO42: J24.E22 ; also sheet 3
DIO43: J24.E21 ; also sheet 3
DIO44: J24.E19 ; also sheet 3
DIO45: J24.E18 ; also sheet 3
DIO46: J24.E16 ; also sheet 3
DIO47: J24.E15 ; also sheet 3
DIO48: J24.B39 ; also sheet 3
DIO49: J24.B37 ; also sheet 3
DIO50: J24.B36
DIO51: J24.B34
DIO52: J24.B33 ; also sheet 4
DIO53: J24.B31 ; also sheet 4
DIO54: J24.B30 ; also sheet 4
DIO55: J24.B28 ; also sheet 4
DIO56: J24.B27 ; also sheet 4
DIO57: J24.B25 ; also sheet 4
DIO58: J24.B24 ; also sheet 4
DIO59: J24.B22 ; also sheet 4
DIO60: J24.B21 ; also sheet 4
DIO61: J24.B19 ; also sheet 4
DIO62: J24.B18 ; also sheet 4
DIO64: J24.D38
DIO65: J24.D37
DIO66: J24.D35
DIO67: J24.D34
DIO68: J24.D32
DIO69: J24.D31
DIO70: J24.D29
DIO71: J24.D28
DIO72: J24.D26
DIO73: J24.D25
DIO74: J24.D23
DIO75: J24.D22
DIO76: J24.D20
DIO77: J24.D19 ; also sheet 4
DIO78: J24.D17 ; also sheet 4
DIO79: J24.D16 ; also sheet 4
DIO80: J24.A40 ; also sheet 3
DIO81: J24.A38 ; also sheet 3
DIO82: J24.A37 ; also sheet 3
DIO83: J24.A35 ; also sheet 3
DIO84: J24.A34
DIO85: J24.A32 ; also sheet 4
DIO86: J24.A31 ; also sheet 4
DIO87: J24.A29 ; also sheet 4
DIO88: J24.A28 ; also sheet 4
DIO89: J24.A26 ; also sheet 4
DIO90: J24.A25 ; also sheet 4
DIO91: J24.A23 ; also sheet 4
DIO92: J24.A22 ; also sheet 4
DIO93: J24.A20 ; also sheet 4
DIO94: J24.A19 ; also sheet 4
DIO95: J24.A17 ; also sheet 4
DONE#_DIO2[1]: J1.15 J24.B9
GND: J1.14 J1.MH1 J1.MH2 J24.A3 J24.A4 J24.A9 J24.A12 J24.A15 J24.A18 J24.A21 J24.A24 J24.A27 J24.A30 J24.A33 J24.A36 J24.A39 J24.B1 J24.B2 J24.B5 J24.B8 J24.B11 J24.B14 J24.B17 J24.B20 J24.B23 J24.B26 J24.B29 J24.B32 J24.B35 J24.B38 J24.C3 J24.C4 J24.C7 J24.C10 J24.C13 J24.C16 J24.C19 J24.C22 J24.C25 J24.C28 J24.C31 J24.C34 J24.C37 J24.C40 J24.D1 J24.D2 J24.D5 J24.D9 J24.D12 J24.D15 J24.D18 J24.D21 J24.D24 J24.D27 J24.D30 J24.D33 J24.D36 J24.D39 J24.E3 J24.E4 J24.E7 J24.E8 J24.E11 J24.E14 J24.E17 J24.E20 J24.E23 J24.E26 J24.E29 J24.E32 J24.E35 J24.E38 J24.F1 J24.F2 J24.F5 J24.F6 J24.F13 J24.F16 J24.F19 J24.F22 J24.F25 J24.F28 J24.F31 J24.F34 J24.F37 ; also sheet 1,2,3,4
ID_SELECT#[1]: J1.1 J24.D7
MISO_DIO6[1]: J1.12 J24.E12
MOSI_DIO7[1]: J1.6 J24.B10
N$15: J24.B16
OSCLK_DIO0[1]: J1.10 J24.D10
SLEEP[1]: J1.8 J24.C8
SPI_CLK[1]: J1.11 J24.A11
SPICS#_DIO5[1]: J1.2 J24.A10
SPIFUNC_DIO4[1]: J1.7 J24.E9
TRIG_DIO1[1]: J1.5 J24.D11
Unconnected: J1.3 J1.13 J24.A1 J24.A2 J24.A5 J24.A6 J24.A7 J24.A8 J24.A13 J24.A14 J24.B3 J24.B4 J24.B6 J24.B7 J24.B12 J24.B13 J24.B40 J24.C1 J24.C2 J24.C5 J24.C6 J24.C9 J24.C11 J24.C12 J24.C14 J24.C15 J24.D3 J24.D4 J24.D6 J24.D13 J24.D14 J24.D40 J24.E1 J24.E2 J24.E5 J24.E6 J24.E10 J24.E13 J24.E39 J24.E40 J24.F3 J24.F4 J24.F7 J24.F14 J24.F39 J24.F40

### Notes on the sheet
- RMC Connector
- C-Series Module Connector

## Library data of the parts
C1-C11 C13-C18 = rcl:C-EU: CAPACITOR, European symbol; SPICEPREFIX: C
C12 = sbrio_backplane:875105144010: Wurth Elektronik 330uF 6.3 V dc Aluminium Polymer Capacitor, WCAP-PSLP Series 2000h 5.8 (Dia.) x 6.15mm Source: Datasheet <https://componentsearchengine.com/Datasheets/2/875105144010.pdf>; DESCRIPTION: Wurth Elektronik 330uF 6.3 V dc Aluminium Polymer Capacitor, WCAP-PSLP Series 2000h 5.8 (Dia.) x 6.15mm; HEIGHT: 5.8mm; MANUFACTURER_NAME: Wurth Elektronik; MANUFACTURER_PART_NUMBER: 875105144010; MOUSER_PART_NUMBER: 710-875105144010; MOUSER_PRICE-STOCK: https://www.mouser.com/Search/Refine.aspx?Keyword=710-875105144010
J1 = sbrio_backplane:L717HDE15PD4CH4R: D-Sub High Density Connectors 15P Sz E Hi Density Pin Rear Insert 4-40 Source: Datasheet <https://datasheet.datasheetarchive.com/originals/distributors/DKDS-1/3941.pdf>; ARROW_PART_NUMBER: L717HDE15PD4CH4R; ARROW_PRICE-STOCK: https://www.arrow.com/en/products/l717hde15pd4ch4r/amphenol-fci; DESCRIPTION: D-Sub High Density Connectors 15P Sz E Hi Density Pin Rear Insert 4-40; HEIGHT: 12.93mm; MANUFACTURER_NAME: Amphenol; MANUFACTURER_PART_NUMBER: L717HDE15PD4CH4R; MOUSER_PART_NUMBER: 523-L717HDE15PD4CH4R; MOUSER_PRICE-STOCK: https://www.mouser.co.uk/ProductDetail/Amphenol-Commercial-Products/L717HDE15PD4CH4R?qs=L9nZOOhNkwctvQLHpK5cGw%3D%3D
J2 = sbrio_backplane:1054301102; COPYRIGHT: Copyright (C) 2022 Ultra Librarian. All rights reserved.; MANUFACTURER_PART_NUMBER: 1054301102; MFR_NAME: Molex Connector Corporation
J3 = sbrio_backplane:5011902017; COPYRIGHT: Copyright (C) 2022 Ultra Librarian. All rights reserved.; MANUFACTURER_PART_NUMBER: 5011902017; MFR_NAME: Molex Connector Corporation
J4-J13 = sbrio_backplane:5013310807; COPYRIGHT: Copyright (C) 2022 Ultra Librarian. All rights reserved.; DIGI-KEY_PART_NUMBER_1: 23-5013310807TR-ND; DIGI-KEY_PART_NUMBER_2: WM7885CT-ND; DIGI-KEY_PART_NUMBER_3: WM7885DKR-ND; MANUFACTURER_PART_NUMBER: 5013310807; MFR_NAME: Molex Connector Corporation
J14-J23 = sbrio_backplane:5013311007; COPYRIGHT: Copyright (C) 2022 Ultra Librarian. All rights reserved.; DIGI-KEY_PART_NUMBER_1: WM7887TR-ND; DIGI-KEY_PART_NUMBER_2: WM7887CT-ND; DIGI-KEY_PART_NUMBER_3: WM7887DKR-ND; MANUFACTURER_PART_NUMBER: 5013311007; MFR_NAME: Molex Connector Corporation
J24 = SEAM-40-03.0-S-06-2-A-K-TR:SEAM-40-03.0-S-06-2-A-K-TR: Check availability <https://pricing.snapeda.com/parts/SEAM-40-03.0-S-06-2-A-K-TR/Samtec/view-part?ref=eda>; AVAILABILITY: In Stock; DESCRIPTION: SEAM - Samtec 1.27mm SEARAY™ High-Speed High-Density Open-Pin-Field Array Terminal; MF: Samtec; MP: SEAM-40-03.0-S-06-2-A-K-TR; PACKAGE: None; PRICE: None; PURCHASE-URL: https://pricing.snapeda.com/search/part/SEAM-40-03.0-S-06-2-A-K-TR/?ref=eda
J25 = sbrio_backplane:5055670271; COPYRIGHT: Copyright (C) 2022 Ultra Librarian. All rights reserved.; DIGI-KEY_PART_NUMBER_1: WM17038TR-ND; DIGI-KEY_PART_NUMBER_2: WM17038CT-ND; DIGI-KEY_PART_NUMBER_3: WM17038DKR-ND; MANUFACTURER_PART_NUMBER: 5055670271; MFR_NAME: Molex Connector Corporation
J26-J29 = sbrio_backplane:SAMTEC-TST-110-01-X-D; DESCRIPTION: TST - Samtec 2.54mm Shrouded Through Hole Terminal Strip Cable Mate; DIGI-KEY_PART_NUMBER: SAM13027-ND; MF: Samtec; MP: TST-110-01-S-D; PACKAGE: None; PURCHASE-URL: https://pricing.snapeda.com/search/part/TST-110-01-S-D/?ref=eda
L1 = sbrio_backplane:74437324068: SMD Power Inductor WE-LHMI Source: Datasheet <http://componentsearchengine.com/Datasheets/1/74437324068.pdf>; DESCRIPTION: SMD Power Inductor WE-LHMI; HEIGHT: mm; MANUFACTURER_NAME: Wurth Elektronik; MANUFACTURER_PART_NUMBER: 74437324068; MOUSER_PART_NUMBER: 710-74437324068; MOUSER_PRICE-STOCK: https://www.mouser.co.uk/ProductDetail/Wurth-Elektronik/74437324068?qs=cFlH0mFHHFrzF3cfO5yZHA%3D%3D
R1 R2 = rcl:R-US_: RESISTOR, American symbol; SPICEPREFIX: R
RN1-RN10 = sbrio_backplane:742C083470JP: RES ARRAY 4 RES 120 OHM 1206; DESCRIPTION: 47 Ohm ±5% 62.5mW Power Per Element Isolated 4 Resistor Network/Array ±200ppm/°C 1206 (3216 Metric), Concave, Long Side Terminals; DIGI-KEY_PART_NUMBER: 742C083470JPTR-ND; MF: CTS Components; MP: 742C083470JP; PACKAGE: 1206 CTS Resistor; PURCHASE-URL: https://pricing.snapeda.com/search/part/742C083470JP/?ref=eda
U1-U10 = sbrio_backplane:AM26LV32EIPWR; COPYRIGHT: Copyright (C) 2022 Ultra Librarian. All rights reserved.; DIGI-KEY_PART_NUMBER_1: 296-24696-1-ND; DIGI-KEY_PART_NUMBER_2: 296-24696-2-ND; DIGI-KEY_PART_NUMBER_3: 296-24696-6-ND; MANUFACTURER_PART_NUMBER: AM26LV32EIPWR; MFR_NAME: Texas Instruments
U11 = sbrio_backplane:LP3962EMP-3.3: Fast Ultra Low Dropout Linear Regulators; DESCRIPTION: 1.5-A, high-accuracy, low-dropout voltage regulator with enable; DIGI-KEY_PART_NUMBER: LP3962EMP-3.3/NOPBTR-ND; MF: Texas Instruments; MP: LP3962EMP-3.3/NOPB; PACKAGE: SOT-223-5 Texas Instruments; PURCHASE-URL: https://pricing.snapeda.com/search/part/LP3962EMP-3.3/NOPB/?ref=eda

## Net classes
1 RS422: width 0.152 mm, clearance 0.26 mm
2 Analog: width 0.305 mm, clearance 0.305 mm